# Altium schematic sheet P1.SchDoc
size A
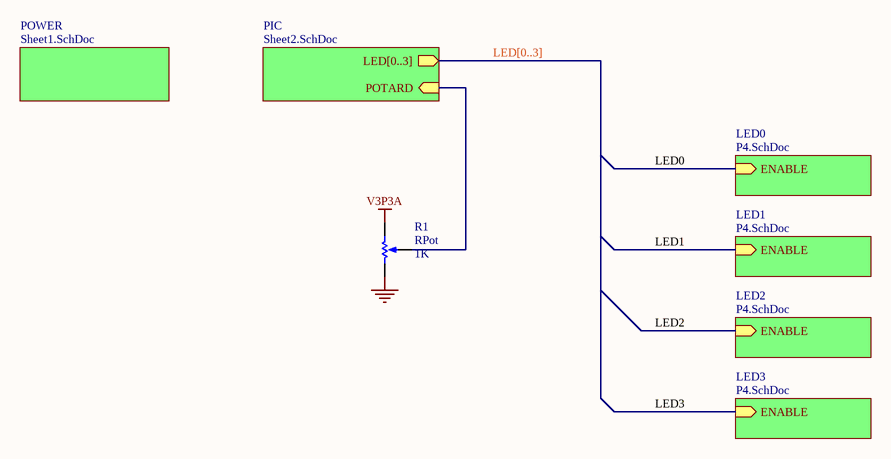
[diagram p0: P1.SchDoc]

## Parts
R1  RPot  value 1K  [VR5]

## Sub-sheets
LED0 = P4.SchDoc: ENABLE (in)
LED1 = P4.SchDoc: ENABLE (in)
LED2 = P4.SchDoc: ENABLE (in)
LED3 = P4.SchDoc: ENABLE (in)
PIC = Sheet2.SchDoc: POTARD (in), LED[0..3] (out)
POWER = Sheet1.SchDoc: no entries

## Nets
GND: R1.2(BOT)
V3P3A: R1.1(TOP)
LED0: sheet LED0/ENABLE
LED1: sheet LED1/ENABLE
LED2: sheet LED2/ENABLE
LED3: sheet LED3/ENABLE
NetR1_3: R1.3(TAP) ; sheet PIC/POTARD

## Buses and harness runs
bus LED[0..3] = sheet PIC/LED[0..3]

## Library data of the parts
R1 = RPot: Potentiometer; Sim Note: Enter the Resistance value and the set point into parameter fields.; Set Position: 0.5; Published: 8-Jun-2000; LatestRevisionDate: 17-Jul-2002; LatestRevisionNote: Re-released for DXP Platform.; PackageReference: VR5; Publisher: Altium Limited; PackageDescription: Variable Resistor, Thru-Hole; 3 Leads